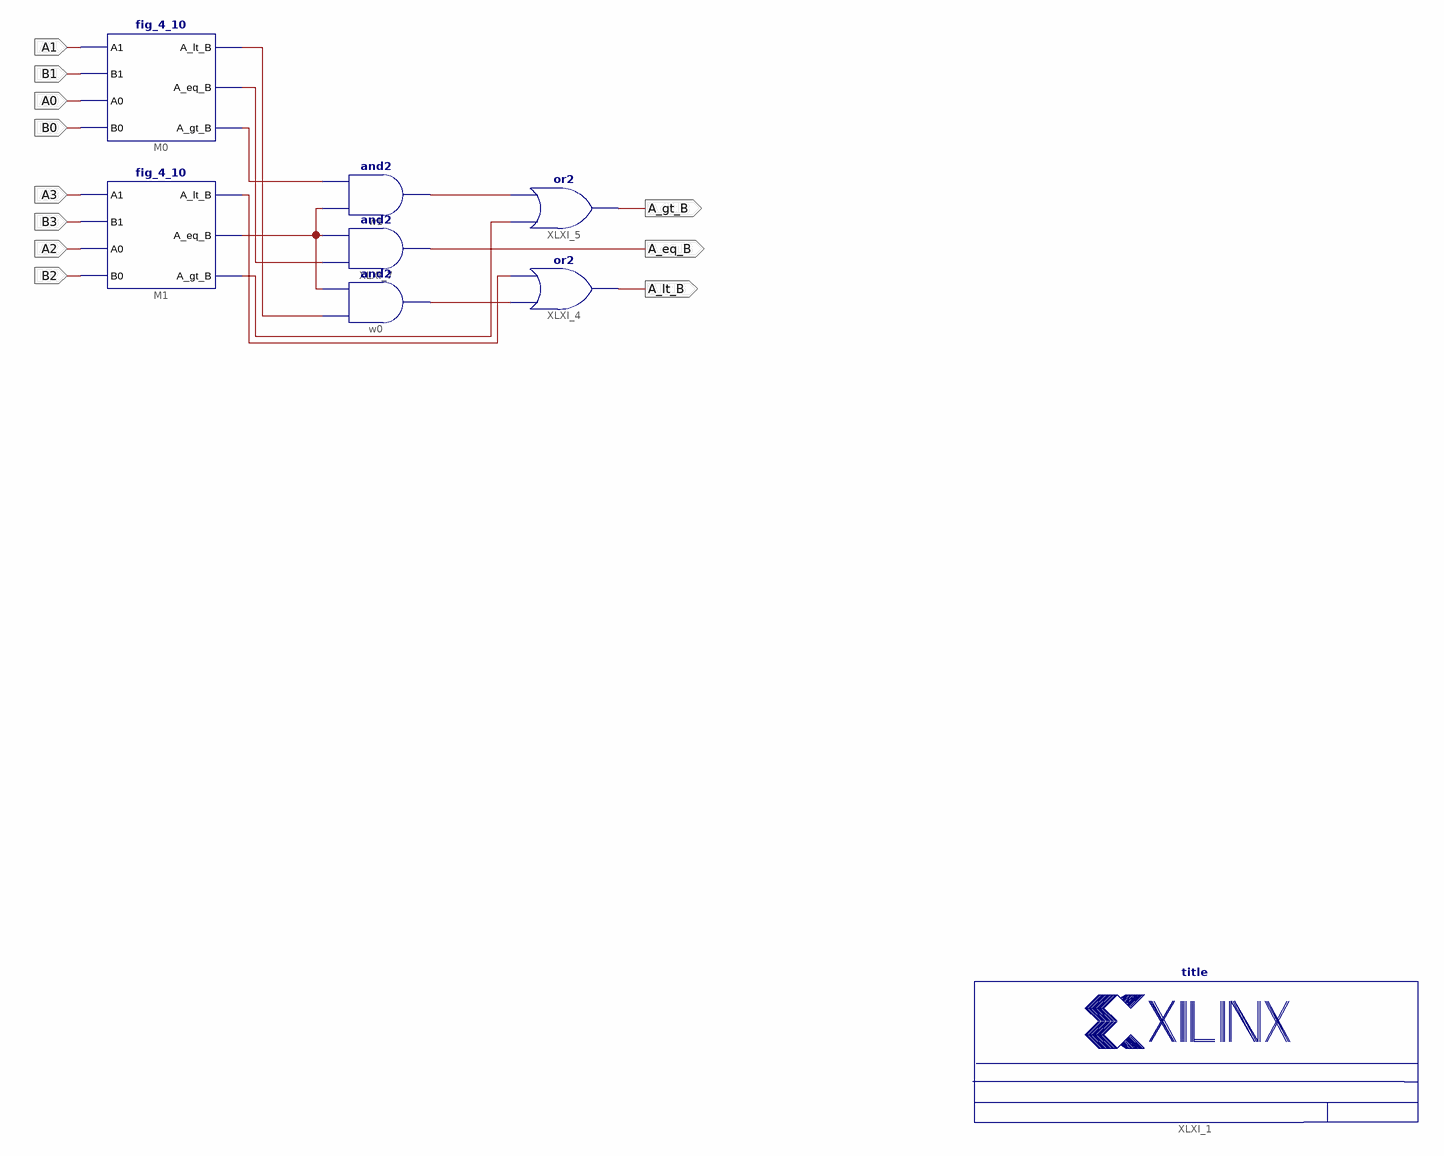
[diagram p0: schematic sheet 1]
// Xilinx ISE schematic ex_4_5.sch (spartan3e) as structural Verilog: 8 symbols, 11 ports
module ex_4_5 (
  input  A1,
  input  B1,
  input  A0,
  input  B0,
  input  A3,
  input  B3,
  input  A2,
  input  B2,
  output A_eq_B,
  output A_gt_B,
  output A_lt_B
);

  wire XLXN_9, XLXN_10, XLXN_12, XLXN_14, XLXN_15, XLXN_16, XLXN_17, XLXN_18;

  title #(.TitleFieldText("4bit comparator"), .NameFieldText("Example 4.5")) XLXI_1 ();
  fig_4_10 M0 (.A1(A1), .B1(B1), .A0(A0), .B0(B0), .A_lt_B(XLXN_14), .A_eq_B(XLXN_12), .A_gt_B(XLXN_10));
  fig_4_10 M1 (.A1(A3), .B1(B3), .A0(A2), .B0(B2), .A_lt_B(XLXN_17), .A_eq_B(XLXN_9), .A_gt_B(XLXN_15));
  and w1 (XLXN_16, XLXN_9, XLXN_10);
  or XLXI_4 (A_lt_B, XLXN_18, XLXN_17);
  and XLXI_7 (A_eq_B, XLXN_12, XLXN_9);
  and w0 (XLXN_18, XLXN_14, XLXN_9);
  or XLXI_5 (A_gt_B, XLXN_15, XLXN_16);
endmodule
